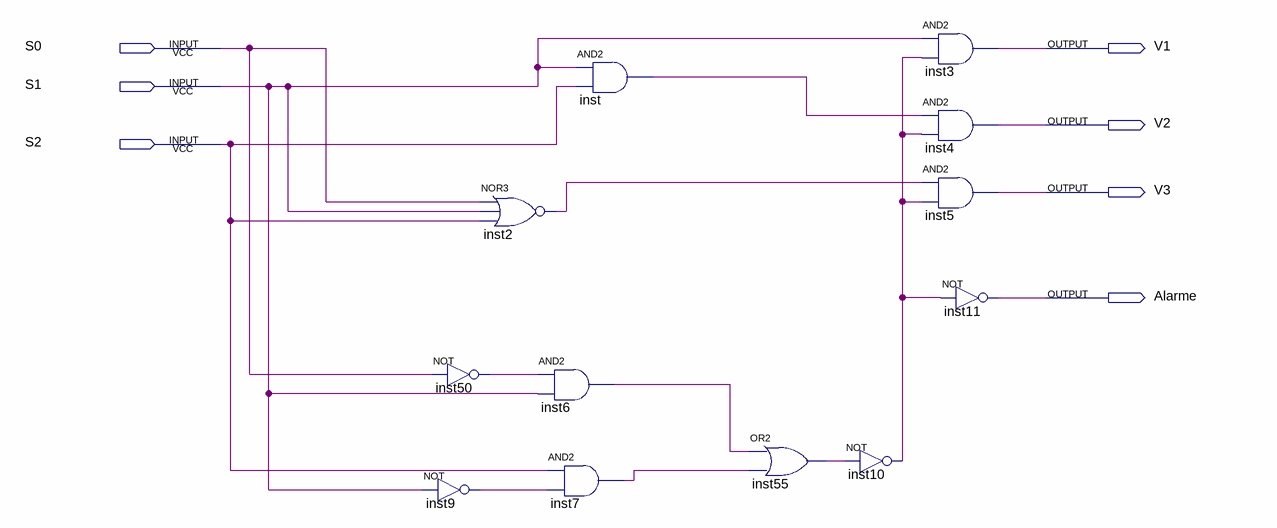
[diagram p0: schematic sheet]
// Quartus schematic Aula3.bdf as structural Verilog: 12 symbols, 7 pins
module Aula3 (
  input  S0,
  input  S1,
  input  S2,
  output V1,
  output V2,
  output V3,
  output Alarme
);

  wire inst2_out, inst6_out, inst7_out, inst9_out, inst10_out, inst50_out, inst55_out, inst_out;

  not inst50 (inst50_out, S0);
  not inst9 (inst9_out, S1);
  nor inst2 (inst2_out, S0, S1, S2);
  and inst6 (inst6_out, inst50_out, S1);
  and inst7 (inst7_out, S2, inst9_out);
  and inst (inst_out, S1, S2);
  or inst55 (inst55_out, inst6_out, inst7_out);
  not inst10 (inst10_out, inst55_out);
  and inst3 (V1, S1, inst10_out);
  and inst4 (V2, inst_out, inst10_out);
  and inst5 (V3, inst2_out, inst10_out);
  not inst11 (Alarme, inst10_out);
endmodule
